# Altium schematic sheet USB OTG FS.SchDoc: USB OTG FS
size A4; CompanyName: STMicroelectronics; Organization: Microcontrollers Division; DocumentNumber: 15; SheetNumber: 7; SheetTotal: 19
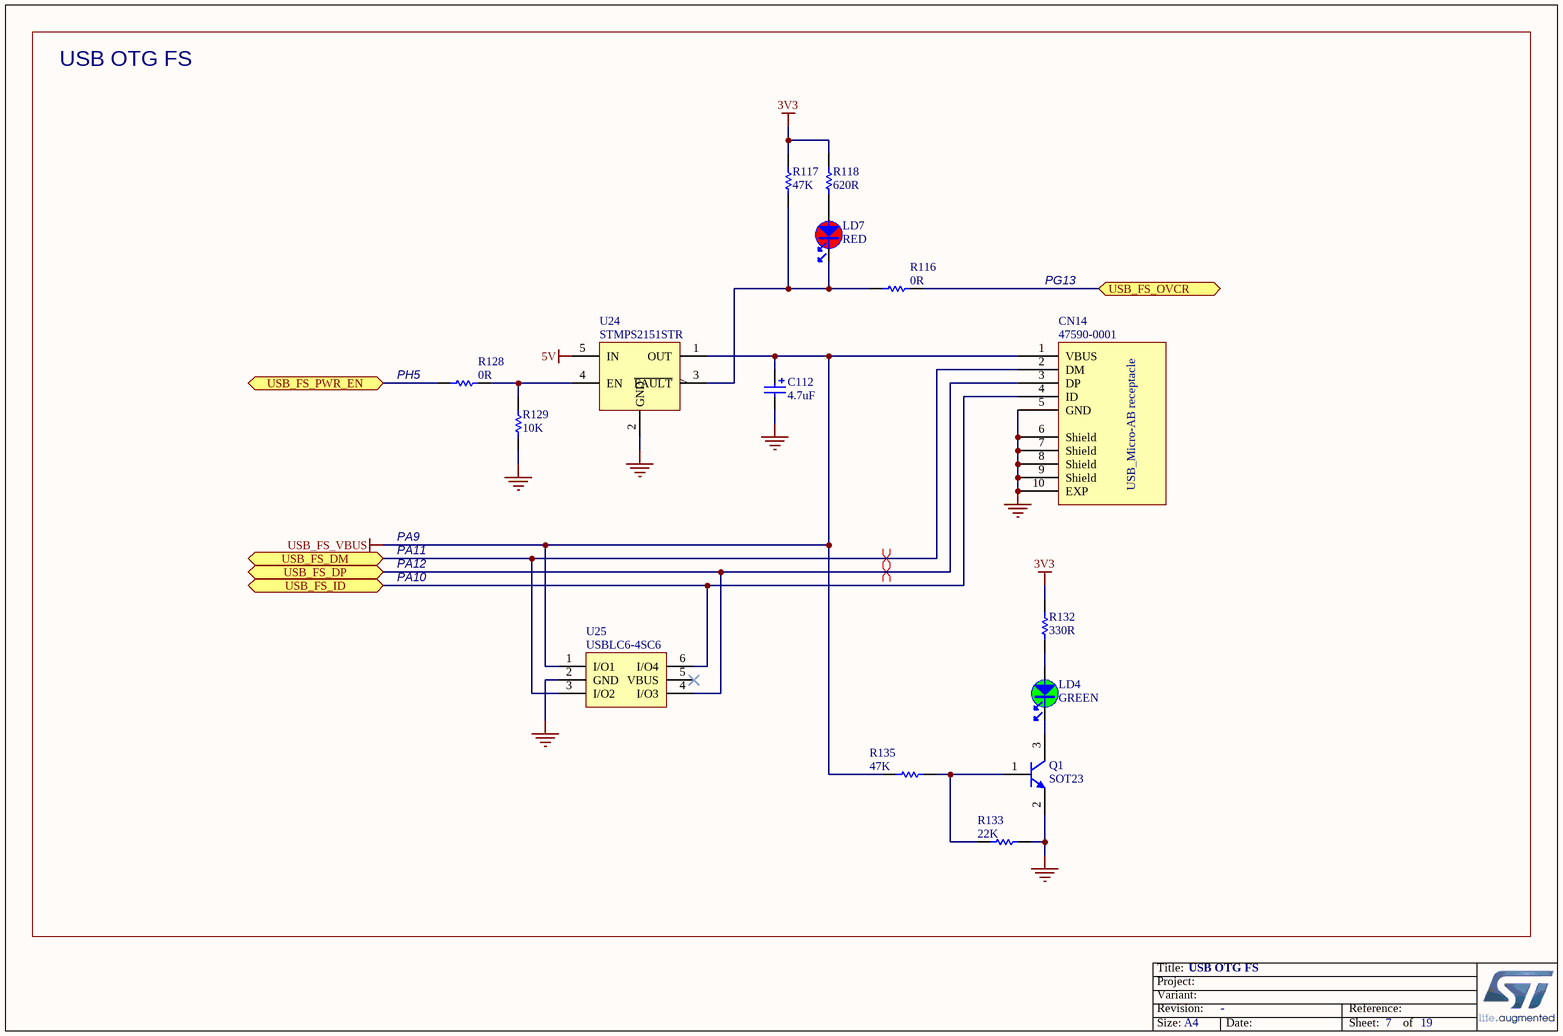
[diagram p0: USB OTG FS.SchDoc]

## Parts
C112  value 4.7uF  [CPOL_VISHAY_TANTAL-595D_1407_H220]  (hidden comment: Cap_POL_TANA)
CN14  Manufacturer_Part_Number: 47590-0001  [CON_USBMICROAB_MOLEX_47590-0001_H3]  (hidden comment: USB_uAB_47590.0001)
LD4  value GREEN  [LED_0603_GREEN]  (hidden comment: LED_green)
LD7  value RED  [LED_0603_RED]  (hidden comment: LED_red)
Q1  value SOT23  [NPN_SOT23]  (hidden comment: 9013-SOT23)
R116  value 0R  [R0402]  (hidden comment: Resistor)
R117  value 47K  [R0402]  (hidden comment: Resistor)
R118  value 620R  [R0402]  (hidden comment: Resistor)
R128  value 0R  [R0402]  (hidden comment: Resistor)
R129  value 10K  [R0402]  (hidden comment: Resistor)
R132  value 330R  [R0402]  (hidden comment: Resistor)
R133  value 22K  [R0402]  (hidden comment: Resistor)
R135  value 47K  [R0402]  (hidden comment: Resistor)
U24  STMPS2151STR  [MOS_SOT23-5L]
U25  USBLC6-4SC6  [ESD_SOT23-6L]

## Ports
USB_FS_DM, USB_FS_DP, USB_FS_ID, USB_FS_OVCR, USB_FS_PWR_EN

## Nets
3V3: R117.2 R118.2 R132.2
5V: U24.5(IN)
GND: C112.2 CN14.5(GND) CN14.6(Shield) CN14.7(Shield) CN14.8(Shield) CN14.9(Shield) CN14.10(EXP) Q1.2(E) R129.1 R133.2 U24.2(GND) U25.2(GND)
USB_FS_VBUS: C112.1 CN14.1(VBUS) R135.2 U24.1(OUT) U25.1(I/O1)
USB_FS_DM: CN14.2(DM) U25.3(I/O2) ; port USB_FS_DM
USB_FS_DP: CN14.3(DP) U25.4(I/O3) ; port USB_FS_DP
USB_FS_ID: CN14.4(ID) U25.6(I/O4) ; port USB_FS_ID
USB_FS_OVCR: R116.2 ; port USB_FS_OVCR
USB_FS_PWR_EN: R128.1 ; port USB_FS_PWR_EN
NetLD4_1: LD4.1 R132.1
NetLD4_2: LD4.2 Q1.3(C)
NetLD7_1: LD7.1 R118.1
NetLD7_2: LD7.2 R116.1 R117.1 U24.3(~{FAULT})
NetQ1_1: Q1.1(B) R133.1 R135.1
NetR128_2: R128.2 R129.2 U24.4(EN)

Not connected (* = marked no-connect by the designer): U25 5(VBUS)*

## Layout directives
differential pair: USB_FS_DM, USB_FS_DP

## Notes on the sheet
- USB OTG FS
- PG13
- (near R128) PH5
- PA9
- PA10
- PA11
- PA12
- Title:
- Project:
- Size:
- Revision:
- Variant:
- A4
- -
- Date:
- Reference:
- Sheet:
- of
- (in symbol MCD-00022) USB_Micro-AB receptacle

## Library data of the parts
C112 = MCD-00595: Capacitor, Tantalum, 4.7uF, 16V, +/-10%, 595D case A; Manufacturer_Part_Number: 595D475X9016A2T; Manufacturer: VISHAY; Order_Code_RS: 117-303; Provided_By: SUBCO; Revision: July-2002: Re-released for DXP Platform.; Internal_Part_Number: MCD-00595; Status: Footprint available; Part_Type: Capacitor; ComponentLink1Description: Datasheet; ComponentLink1URL: http://tunmcdsvn.tun.st.com/Component_Datasheet_Library/Trunk/Capacitors/VISHAY_CAPACITOR_TANTALUM_595D; Order_Code_Digikey: 595D475X9016A2T-ND; Order_Code_Farnell: 1166805
CN14 = MCD-00022: USB-MICRO-AB, 0.65mm, RA, SMT, Top Mount (compatible with MCD-00661 USB certified); Part_Type: Connector; Manufacturer: MOLEX; Alternate_Manufacturer_Part_Number: ZX62RD-AB-5P8(30); Alternate_Manufacturer: HIROSE; Provided_By: SUBCO; Internal_Part_Number: MCD-00022; Value: USB_uAB_47590.0001; Status: Released; ComponentLink1Description: Datasheet; ComponentLink1URL: http://tunmcdsvn.tun.st.com/Component_Datasheet_Library/Trunk/Connectors/Molex_Connector-USB-microAB_47590-0001
LD4 = MCD-00050: LED, Green, 0603; Part_Type: Display; Manufacturer_Part_Number: 19-213SYGC/S530-E2/TR8; Manufacturer: EVERLIGHT; Provided_By: SUBCO; Internal_Part_Number: MCD-00050; Status: Released; ComponentLink1Description: Datasheet; ComponentLink1URL: http://tunmcdsvn.tun.st.com/Component_Datasheet_Library/Trunk/Display/Everlight_SMD-LED-GREEN_19-213SYGC-S530-XX-TR8-v3.doc; Package: LED 0603
LD7 = MCD-00049: LED, Red, 0603; Manufacturer_Part_Number: 19-213-R6C-AP1Q2B/3T; Manufacturer: EVERLIGHT; Part_Type: Display; Provided_By: SUBCO; Internal_Part_Number: MCD-00049; ComponentLink1Description: Datasheet; Status: Released; ComponentLink1URL: http://tunmcdsvn.tun.st.com/Component_Datasheet_Library/Trunk/Display/Everlight_SMD-LED-RED_19-213-R6C-AP1Q2B-3T-V3.doc; Package: LED 0603
Q1 = MCD-00073: NPN Bipolar Transistor; Part_Type: IC; Manufacturer_Part_Number: BSR14; Manufacturer: ON SEMICONDUCTOR; Alternate_Manufacturer_Part_Number: MMBT2222ALT1G / MMBT2222ALT3G; Provided_By: SUBCO; Revision: *; Internal_Part_Number: MCD-00073; Status: Released; ComponentLink1Description: Datasheet; ComponentLink1URL: http://tunmcdsvn.tun.st.com/Component_Datasheet_Library/Trunk/IC/NXP_Transistor_BSR14; Alternate_Manufacturer: ON SEMICONDUCTOR
R116 R128 = MCD-00052: Resistor,0R,0402,5%,1/16W; Manufacturer_Part_Number: RC0402JR-070RL; Manufacturer: YAGEO; Provided_By: SUBCO; Internal_Part_Number: MCD-00052; Status: Released; Part_Type: Resistor; Package: R0402; ComponentLink1Description: Datasheet; ComponentLink1URL: http://tunmcdsvn.tun.st.com/Component_Datasheet_Library/Trunk/Resistors/Yageo_Resistor_RC0402-series
R117 R135 = MCD-00063: Resistor,47K,0402,1%,1/16W; Manufacturer_Part_Number: RC0402FR-0747KL; Manufacturer: YAGEO; Provided_By: SUBCO; Internal_Part_Number: MCD-00063; Status: Released; Part_Type: Resistor; Package: R0402; ComponentLink1Description: Datasheet; ComponentLink1URL: http://tunmcdsvn.tun.st.com/Component_Datasheet_Library/Trunk/Resistors/Yageo_Resistor_RC0402-series
R118 = MCD-00499: Resistor,620R,0402,1%,1/16W; Manufacturer_Part_Number: RC0402FR-07620RL; Manufacturer: YAGEO; Provided_By: SUBCO; Internal_Part_Number: MCD-00499; Status: Released; Part_Type: Resistor; Package: R0402; ComponentLink1Description: Datasheet; ComponentLink1URL: http://tunmcdsvn.tun.st.com/Component_Datasheet_Library/Trunk/Resistors/Yageo_Resistor_RC0402-series
R129 = MCD-00053: Resistor,10K,0402,1%,1/16W; Manufacturer_Part_Number: RC0402FR-0710KL; Manufacturer: YAGEO; Provided_By: SUBCO; Internal_Part_Number: MCD-00053; Status: Released; Part_Type: Resistor; Package: R0402; ComponentLink1Description: Datasheet; ComponentLink1URL: http://tunmcdsvn.tun.st.com/Component_Datasheet_Library/Trunk/Resistors/Yageo_Resistor_RC0402-series
R132 = MCD-00062: Resistor,330R,0402,1%,1/16W; Manufacturer_Part_Number: RC0402FR-07330RL; Manufacturer: YAGEO; Provided_By: SUBCO; Internal_Part_Number: MCD-00062; Status: Released; Part_Type: Resistor; Package: R0402; ComponentLink1Description: Datasheet; ComponentLink1URL: http://tunmcdsvn.tun.st.com/Component_Datasheet_Library/Trunk/Resistors/Yageo_Resistor_RC0402-series
R133 = MCD-00429: Resistor,22K,0402,1%,1/16W; Manufacturer_Part_Number: RC0402FR-0722KL; Manufacturer: YAGEO; Provided_By: SUBCO; Internal_Part_Number: MCD-00429; Status: Released; Part_Type: Resistor; Package: R0402; ComponentLink1Description: Datasheet; ComponentLink1URL: http://tunmcdsvn.tun.st.com/Component_Datasheet_Library/Trunk/Resistors/Yageo_Resistor_RC0402-series
U24 = MCD-00159: 500mA, Enhanced single channel power switches with active high enable pin; Part_Type: IC; Manufacturer: STMICROELECTRONICS; Alternate_Manufacturer_Part_Number: TPS2051C; Alternate_Manufacturer: TEXAS INSTRUMENTS; BMS_Part_Number: 9159009; Provided_By: SUBCO with ST control; Internal_Part_Number: MCD-00159; Value: STMPS2151STR; Status: Released; Manufacturer_Part_Number: STMPS2151STR; ComponentLink1Description: Datasheet; ComponentLink1URL: http://tunmcdsvn.tun.st.com/Component_Datasheet_Library/Trunk/IC/STM_PWR-Switch_STMPS2151STR
U25 = MCD-00250: Very low capacitance ESD protection , 4 lines; Part_Type: IC; Manufacturer: STMICROELECTRONICS; BMS_Part_Number: 9151001; Provided_By: SUBCO with ST control; Internal_Part_Number: MCD-00250; Value: USBLC6-4SC6; Status: Released; Manufacturer_Part_Number: USBLC6-4SC6; ComponentLink1Description: Datasheet; ComponentLink1URL: http://tunmcdsvn.tun.st.com/Component_Datasheet_Library/Trunk/Diodes/STM_ESD_USBLC6-4SC6